# Altium schematic sheet Block Diagram.SchDoc: B202AA Block Diagram
size 393 x 292 mm; SheetNumber: 1; SheetTotal: 12
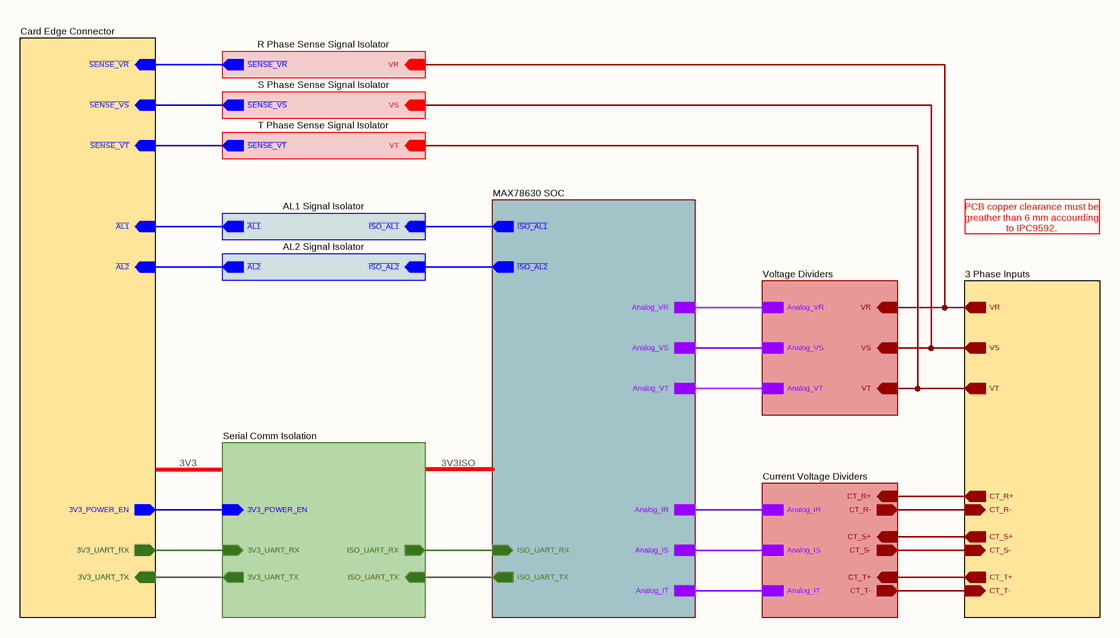
[diagram p0: Block Diagram.SchDoc]

## Sub-sheets
3 Phase Inputs = Energy Inputs.SchDoc: VS (out), VR (out), CT_S+ (out), CT_T+ (out), VT (out), CT_R+ (out), CT_R- (in), CT_S- (in), CT_T- (in)
AL1 Signal Isolator = AL1 Signal Isolation.SchDoc: ~{AL1} (out), ~{ISO_AL1} (in)
AL2 Signal Isolator = AL2 Signal Isolation.SchDoc: ~{AL2} (out), ~{ISO_AL2} (in)
Card Edge Connector = Card Edge Connecgtor.SchDoc: 3V3_UART_RX (out), 3V3_UART_TX (in), ~{AL2} (in), ~{AL1} (in), ~{SENSE_VT} (in), ~{SENSE_VS} (in), ~{SENSE_VR} (in), 3V3_POWER_EN (out)
Current Voltage Dividers = Current Voltage Dividers.SchDoc: Analog_IS, Analog_IT, Analog_IR, CT_T+ (in), CT_S+ (in), CT_R+ (in), CT_R- (out), CT_S- (out), CT_T- (out)
MAX78630 SOC = MAX78630 SOC.SchDoc: Analog_VR, Analog_VS, Analog_VT, Analog_IS, Analog_IT, Analog_IR, ISO_UART_RX (in), ISO_UART_TX (out), ~{ISO_AL1} (out), ~{ISO_AL2} (out)
R Phase Sense Signal Isolator = R Phase Sense Signal Isolation.SchDoc: ~{SENSE_VR} (out), VR (in)
S Phase Sense Signal Isolator = S Phase Sense Signal Isolation.SchDoc: ~{SENSE_VS} (out), VS (in)
Serial Comm Isolation = UART Comm Isolation.SchDoc: 3V3_UART_TX (out), 3V3_UART_RX (in), ISO_UART_RX (out), ISO_UART_TX (in), 3V3_POWER_EN (in)
T Phase Sense Signal Isolator = T Phase Sense Signal Isolation.SchDoc: ~{SENSE_VT} (out), VT (in)
Voltage Dividers = Phase Voltage Dividers.SchDoc: Analog_VR, Analog_VS, Analog_VT, VR (in), VT (in), VS (in)

## Nets
(unnamed): sheet MAX78630 SOC/Analog_VR, sheet Voltage Dividers/Analog_VR
(unnamed): sheet MAX78630 SOC/Analog_VS, sheet Voltage Dividers/Analog_VS
(unnamed): sheet MAX78630 SOC/Analog_VT, sheet Voltage Dividers/Analog_VT
(unnamed): sheet MAX78630 SOC/Analog_IS, sheet Current Voltage Dividers/Analog_IS
(unnamed): sheet MAX78630 SOC/Analog_IT, sheet Current Voltage Dividers/Analog_IT
(unnamed): sheet MAX78630 SOC/Analog_IR, sheet Current Voltage Dividers/Analog_IR
(unnamed): sheet MAX78630 SOC/ISO_UART_RX, sheet Serial Comm Isolation/ISO_UART_RX
(unnamed): sheet MAX78630 SOC/ISO_UART_TX, sheet Serial Comm Isolation/ISO_UART_TX
(unnamed): sheet MAX78630 SOC/~{ISO_AL1}, sheet AL1 Signal Isolator/~{ISO_AL1}
(unnamed): sheet MAX78630 SOC/~{ISO_AL2}, sheet AL2 Signal Isolator/~{ISO_AL2}
(unnamed): sheet Voltage Dividers/VR, sheet 3 Phase Inputs/VR, sheet R Phase Sense Signal Isolator/VR
(unnamed): sheet Voltage Dividers/VT, sheet 3 Phase Inputs/VT, sheet T Phase Sense Signal Isolator/VT
(unnamed): sheet Voltage Dividers/VS, sheet 3 Phase Inputs/VS, sheet S Phase Sense Signal Isolator/VS
(unnamed): sheet Current Voltage Dividers/CT_T+, sheet 3 Phase Inputs/CT_T+
(unnamed): sheet Current Voltage Dividers/CT_S+, sheet 3 Phase Inputs/CT_S+
(unnamed): sheet Current Voltage Dividers/CT_R+, sheet 3 Phase Inputs/CT_R+
(unnamed): sheet Current Voltage Dividers/CT_R-, sheet 3 Phase Inputs/CT_R-
(unnamed): sheet Current Voltage Dividers/CT_S-, sheet 3 Phase Inputs/CT_S-
(unnamed): sheet Current Voltage Dividers/CT_T-, sheet 3 Phase Inputs/CT_T-
(unnamed): sheet Card Edge Connector/3V3_UART_RX, sheet Serial Comm Isolation/3V3_UART_RX
(unnamed): sheet Card Edge Connector/3V3_UART_TX, sheet Serial Comm Isolation/3V3_UART_TX
(unnamed): sheet Card Edge Connector/~{AL2}, sheet AL2 Signal Isolator/~{AL2}
(unnamed): sheet Card Edge Connector/~{AL1}, sheet AL1 Signal Isolator/~{AL1}
(unnamed): sheet Card Edge Connector/~{SENSE_VT}, sheet T Phase Sense Signal Isolator/~{SENSE_VT}
(unnamed): sheet Card Edge Connector/~{SENSE_VS}, sheet S Phase Sense Signal Isolator/~{SENSE_VS}
(unnamed): sheet Card Edge Connector/~{SENSE_VR}, sheet R Phase Sense Signal Isolator/~{SENSE_VR}
(unnamed): sheet Card Edge Connector/3V3_POWER_EN, sheet Serial Comm Isolation/3V3_POWER_EN

## Notes on the sheet
- PCB copper clearance must be greather than 6 mm accourding to IPC9592.
- 3V3
- 3V3ISO
- © 2021 All rights reserved.
  This document may not, in whole or in part, be copied, photocopied, reproduced, translated or converted to any electronic or machine readable from without prior written permission of Mehmet Günce Akkoyun.
  Engineer contact : akkoyun@me.com
- Property of
- Engineer :
- Date :
- Size :
- A4
- Time :
- Project :
- Page :
- /
- Customer :
- Product ID :
- Module ID :
- Version :
- File :
- Revision :